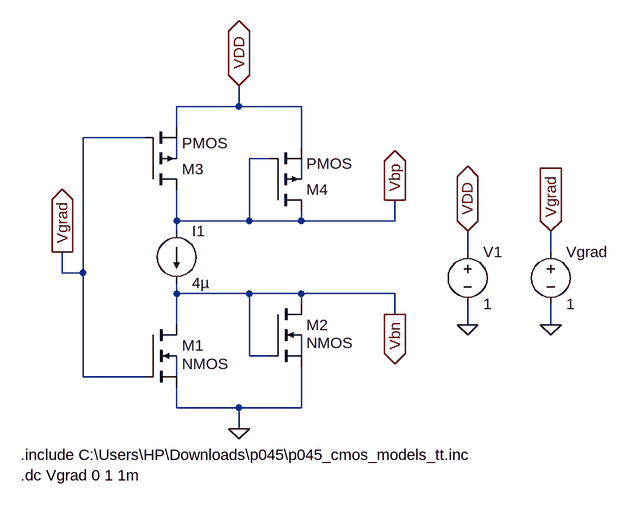
[diagram p0: schematic bias.asc]
bias.asc, the LTspice schematic file:
Version 4
SHEET 1 880 680
WIRE 112 -48 112 -80
WIRE 112 -48 16 -48
WIRE 208 -48 112 -48
WIRE 16 -16 16 -48
WIRE -32 0 -128 0
WIRE 208 16 208 -48
WIRE 16 32 16 0
WIRE 160 32 128 32
WIRE 208 64 208 32
WIRE 16 128 16 80
WIRE 128 128 128 32
WIRE 128 128 16 128
WIRE 208 128 208 112
WIRE 208 128 128 128
WIRE 352 128 352 96
WIRE 352 128 208 128
WIRE 16 144 16 128
WIRE 464 176 464 144
WIRE 592 176 592 144
WIRE -160 208 -160 176
WIRE -128 208 -128 0
WIRE -128 208 -160 208
WIRE 16 240 16 224
WIRE 128 240 16 240
WIRE 208 240 128 240
WIRE 352 240 208 240
WIRE 208 256 208 240
WIRE 352 272 352 240
WIRE 16 288 16 240
WIRE 464 288 464 256
WIRE 592 288 592 256
WIRE 128 336 128 240
WIRE 160 336 128 336
WIRE 208 336 208 304
WIRE -128 368 -128 208
WIRE -32 368 -128 368
WIRE 16 368 16 336
WIRE 16 416 16 384
WIRE 112 416 16 416
WIRE 208 416 208 352
WIRE 208 416 112 416
WIRE 112 448 112 416
FLAG 112 448 0
FLAG 112 -80 VDD
IOPIN 112 -80 BiDir
FLAG -160 176 Vgrad
IOPIN -160 176 Out
FLAG 352 96 Vbp
IOPIN 352 96 Out
FLAG 352 272 Vbn
IOPIN 352 272 Out
FLAG 464 288 0
FLAG 464 144 VDD
IOPIN 464 144 BiDir
FLAG 592 288 0
FLAG 592 144 Vgrad
IOPIN 592 144 In
SYMBOL current 16 144 R0
WINDOW 123 0 0 Left 0
WINDOW 39 0 0 Left 0
SYMATTR InstName I1
SYMATTR Value 4µ
SYMBOL voltage 464 160 R0
WINDOW 123 0 0 Left 0
WINDOW 39 0 0 Left 0
SYMATTR InstName V1
SYMATTR Value 1
SYMBOL voltage 592 160 R0
WINDOW 123 0 0 Left 0
WINDOW 39 0 0 Left 0
SYMATTR InstName Vgrad
SYMATTR Value 1
SYMBOL nmos4 -32 288 R0
WINDOW 3 56 60 Left 2
SYMATTR InstName M1
SYMATTR Value2 l=0.05u w=2u
SYMBOL nmos4 160 256 R0
WINDOW 3 56 60 Left 2
SYMATTR InstName M2
SYMATTR Value2 l=0.05u w=1u
SYMBOL pmos4 -32 80 M180
SYMATTR InstName M3
SYMATTR Value2 l=0.05u w=2u
SYMBOL pmos4 160 112 M180
SYMATTR InstName M4
SYMATTR Value2 l=0.05u w=0.1u
TEXT -224 520 Left 2 !.dc Vgrad 0 1 1m
TEXT -224 488 Left 2 !.include C:\\Users\\HP\\Downloads\\p045\\p045_cmos_models_tt.inc

The netlist it stands for:
* bias.asc
I1 Vbp Vbn 4µ
V1 VDD 0 1
Vgrad Vgrad 0 1
M1 Vbn Vgrad 0 N004 NMOS l=0.05u w=2u
M2 Vbn Vbn 0 N003 NMOS l=0.05u w=1u
M3 Vbp Vgrad VDD N001 PMOS l=0.05u w=2u
M4 Vbp Vbp VDD N002 PMOS l=0.05u w=0.1u
.model NMOS NMOS
.model PMOS PMOS
.lib standard.mos
.dc Vgrad 0 1 1m
.include C:\Users\HP\Downloads\p045\p045_cmos_models_tt.inc
.backanno
.end